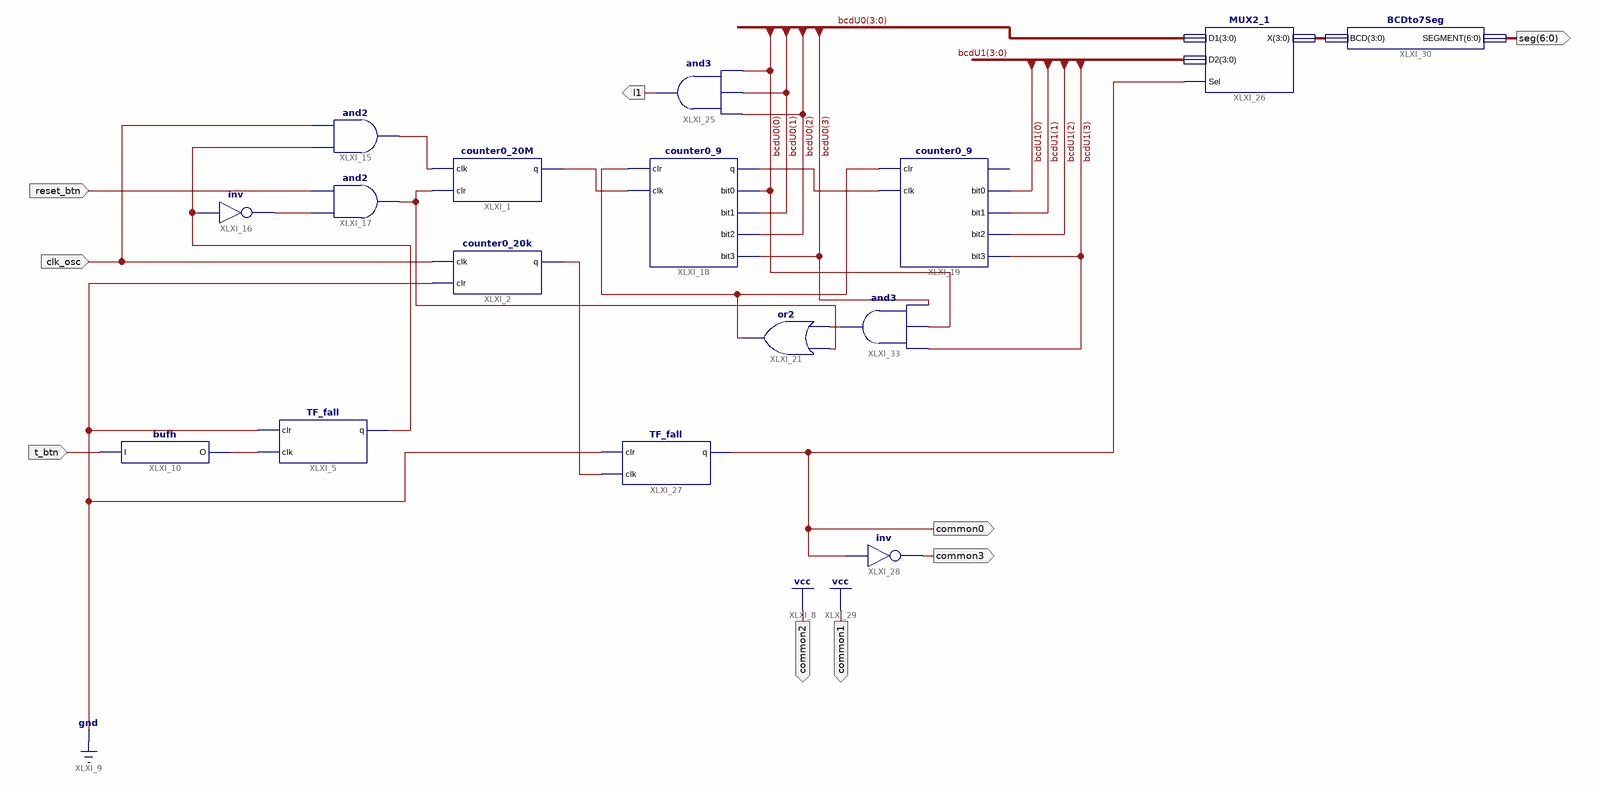
[diagram p0: schematic sheet 1]
// Xilinx ISE schematic top.sch (spartan6) as structural Verilog: 16 symbols, 9 ports
module top (
  input  t_btn,
  input  reset_btn,
  input  clk_osc,
  output l1,
  output common0,
  output common3,
  output common2,
  output common1,
  output [6:0] seg
);

  wire XLXN_3, XLXN_8, XLXN_9, XLXN_62, XLXN_71, XLXN_72, XLXN_73, XLXN_75, XLXN_76, xxxasd;
  wire [3:0] bcdU0, bcdU1, XLXN_68;

  counter0_20k XLXI_2 (.clk(clk_osc), .clr(1'b0), .q(XLXN_62));
  counter0_20M XLXI_1 (.clk(XLXN_8), .clr(XLXN_71), .q(XLXN_72));
  bufh XLXI_10 (.I(t_btn), .O(XLXN_3));
  TF_fall XLXI_5 (.clr(1'b0), .clk(XLXN_3), .q(xxxasd));
  and XLXI_15 (XLXN_8, xxxasd, clk_osc);
  not XLXI_16 (XLXN_9, xxxasd);
  and XLXI_17 (XLXN_71, XLXN_9, reset_btn);
  counter0_9 XLXI_18 (
    .bit0(bcdU0[0]), .bit1(bcdU0[1]), .bit2(bcdU0[2]), .bit3(bcdU0[3]), .clk(XLXN_72), .clr(XLXN_75),
    .q(XLXN_73));
  or XLXI_21 (XLXN_75, XLXN_76, XLXN_71);
  counter0_9 XLXI_19 (
    .bit0(bcdU1[0]), .bit1(bcdU1[1]), .bit2(bcdU1[2]), .bit3(bcdU1[3]), .clk(XLXN_73), .clr(XLXN_75));  // open: q
  and XLXI_25 (l1, bcdU0[0], bcdU0[1], bcdU0[2]);
  MUX2_1 XLXI_26 (.Sel(common0), .D1(bcdU0), .D2(bcdU1), .X(XLXN_68));
  TF_fall XLXI_27 (.clr(1'b0), .clk(XLXN_62), .q(common0));
  not XLXI_28 (common3, common0);
  BCDto7Seg XLXI_30 (.BCD(XLXN_68), .SEGMENT(seg));
  and XLXI_33 (XLXN_76, bcdU0[3], bcdU0[0], bcdU1[3]);

  assign common1 = 1'b1;
  assign common2 = 1'b1;
endmodule
